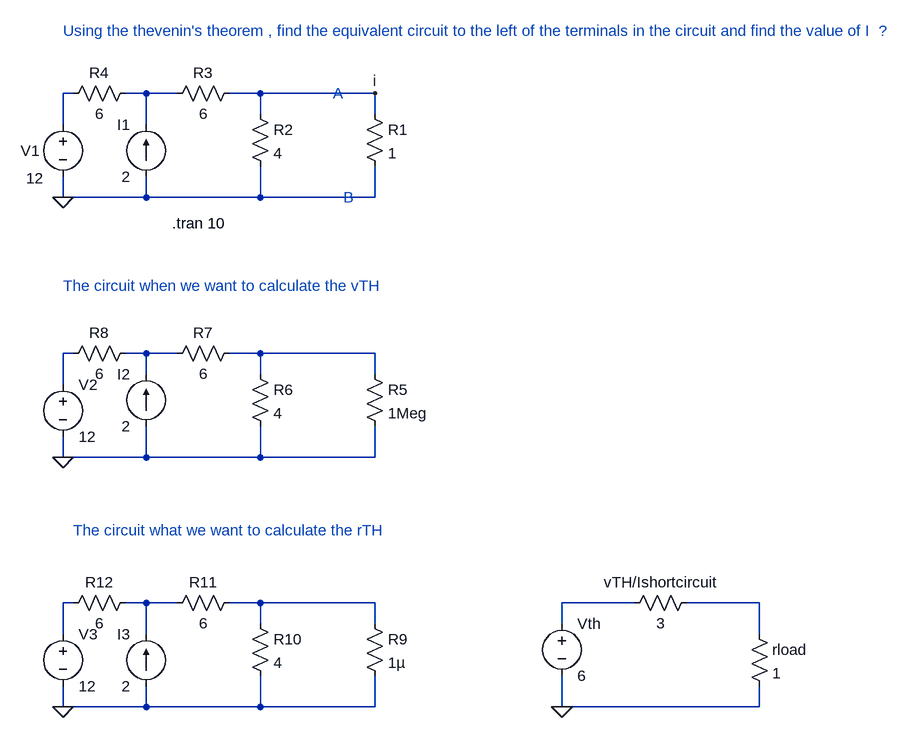
[diagram p0: schematic Lab2_ques1.asc]
Lab2_ques1.asc, the LTspice schematic file:
Version 4
SHEET 1 1136 1344
WIRE -160 112 -176 112
WIRE -48 112 -80 112
WIRE 0 112 -48 112
WIRE 128 112 80 112
WIRE 304 112 128 112
WIRE 128 144 128 112
WIRE 304 144 304 112
WIRE -176 160 -176 112
WIRE -48 160 -48 112
WIRE -176 272 -176 240
WIRE -48 272 -48 240
WIRE -48 272 -176 272
WIRE 128 272 128 224
WIRE 128 272 -48 272
WIRE 304 272 304 224
WIRE 304 272 128 272
WIRE -160 512 -176 512
WIRE -48 512 -80 512
WIRE 0 512 -48 512
WIRE 128 512 80 512
WIRE 304 512 128 512
WIRE -48 544 -48 512
WIRE 128 544 128 512
WIRE 304 544 304 512
WIRE -176 560 -176 512
WIRE -176 672 -176 640
WIRE -48 672 -48 624
WIRE -48 672 -176 672
WIRE 128 672 128 624
WIRE 128 672 -48 672
WIRE 304 672 304 624
WIRE 304 672 128 672
WIRE -160 896 -176 896
WIRE -48 896 -80 896
WIRE 0 896 -48 896
WIRE 128 896 80 896
WIRE 304 896 128 896
WIRE 704 896 592 896
WIRE 896 896 784 896
WIRE 128 928 128 896
WIRE 304 928 304 896
WIRE 592 928 592 896
WIRE -176 944 -176 896
WIRE -48 944 -48 896
WIRE 896 944 896 896
WIRE -176 1056 -176 1024
WIRE -48 1056 -48 1024
WIRE -48 1056 -176 1056
WIRE 128 1056 128 1008
WIRE 128 1056 -48 1056
WIRE 304 1056 304 1008
WIRE 304 1056 128 1056
WIRE 592 1056 592 1008
WIRE 896 1056 896 1024
WIRE 896 1056 592 1056
FLAG 304 112 i
FLAG -176 672 0
FLAG -176 272 0
FLAG -176 1056 0
FLAG 592 1056 0
SYMBOL res 288 128 R0
SYMATTR InstName R1
SYMATTR Value 1
SYMBOL res 112 128 R0
SYMATTR InstName R2
SYMATTR Value 4
SYMBOL res 96 96 R90
WINDOW 0 0 56 VBottom 2
WINDOW 3 32 56 VTop 2
SYMATTR InstName R3
SYMATTR Value 6
SYMBOL res -64 96 R90
WINDOW 0 0 56 VBottom 2
WINDOW 3 32 56 VTop 2
SYMATTR InstName R4
SYMATTR Value 6
SYMBOL current -48 240 R180
WINDOW 0 24 80 Left 2
WINDOW 3 24 0 Left 2
SYMATTR InstName I1
SYMATTR Value 2
SYMBOL voltage -176 144 R0
WINDOW 0 -65 56 Left 2
WINDOW 3 -57 99 Left 2
SYMATTR InstName V1
SYMATTR Value 12
SYMBOL Voltage -176 544 R0
SYMATTR InstName V2
SYMATTR Value 12
SYMBOL Res 288 528 R0
SYMATTR InstName R5
SYMATTR Value 1Meg
SYMBOL Res 112 528 R0
SYMATTR InstName R6
SYMATTR Value 4
SYMBOL Res 96 496 R90
WINDOW 0 0 56 VBottom 2
WINDOW 3 32 56 VTop 2
SYMATTR InstName R7
SYMATTR Value 6
SYMBOL Res -64 496 R90
WINDOW 0 0 56 VBottom 2
WINDOW 3 32 56 VTop 2
SYMATTR InstName R8
SYMATTR Value 6
SYMBOL current -48 624 R180
WINDOW 0 24 80 Left 2
WINDOW 3 24 0 Left 2
SYMATTR InstName I2
SYMATTR Value 2
SYMBOL Res 288 912 R0
SYMATTR InstName R9
SYMATTR Value 1µ
SYMBOL Res 112 912 R0
SYMATTR InstName R10
SYMATTR Value 4
SYMBOL Res 96 880 R90
WINDOW 0 0 56 VBottom 2
WINDOW 3 32 56 VTop 2
SYMATTR InstName R11
SYMATTR Value 6
SYMBOL Res -64 880 R90
WINDOW 0 0 56 VBottom 2
WINDOW 3 32 56 VTop 2
SYMATTR InstName R12
SYMATTR Value 6
SYMBOL Voltage -176 928 R0
SYMATTR InstName V3
SYMATTR Value 12
SYMBOL current -48 1024 R180
WINDOW 0 24 80 Left 2
WINDOW 3 24 0 Left 2
SYMATTR InstName I3
SYMATTR Value 2
SYMBOL Res 880 928 R0
SYMATTR InstName rload
SYMATTR Value 1
SYMBOL Res 800 880 R90
WINDOW 0 0 56 VBottom 2
WINDOW 3 32 56 VTop 2
SYMATTR InstName vTH/Ishortcircuit
SYMATTR Value 3
SYMBOL Voltage 592 912 R0
SYMATTR InstName Vth
SYMATTR Value 6
TEXT -176 16 Left 2 ;Using the thevenin's theorem , find the equivalent circuit to the left of the terminals in the circuit and find the value of I  ?
TEXT 240 112 Left 2 ;A
TEXT 256 272 Left 2 ;B
TEXT -176 408 Left 2 ;The circuit when we want to calculate the vTH
TEXT -160 784 Left 2 ;The circuit what we want to calculate the rTH
TEXT -8 312 Left 2 !.tran 10

The netlist it stands for:
* Lab2_ques1.asc
R1 i 0 1
R2 i 0 4
R3 i N002 6
R4 N002 N001 6
I1 0 N002 2
V1 N001 0 12
V2 N003 0 12
R5 N005 0 1Meg
R6 N005 0 4
R7 N005 N004 6
R8 N004 N003 6
I2 0 N004 2
R9 N008 0 1µ
R10 N008 0 4
R11 N008 N007 6
R12 N007 N006 6
V3 N006 0 12
I3 0 N007 2
rload N010 0 1
R§vTH/Ishortcircuit N010 N009 3
Vth N009 0 6
* Using the thevenin's theorem , find the equivalent circuit to the left of the terminals in the circuit and find the value of I  ?
* A
* B
* The circuit when we want to calculate the vTH
* The circuit what we want to calculate the rTH
.tran 10
.backanno
.end